# EAGLE design EBH-10 (EAGLE 8.7.0)
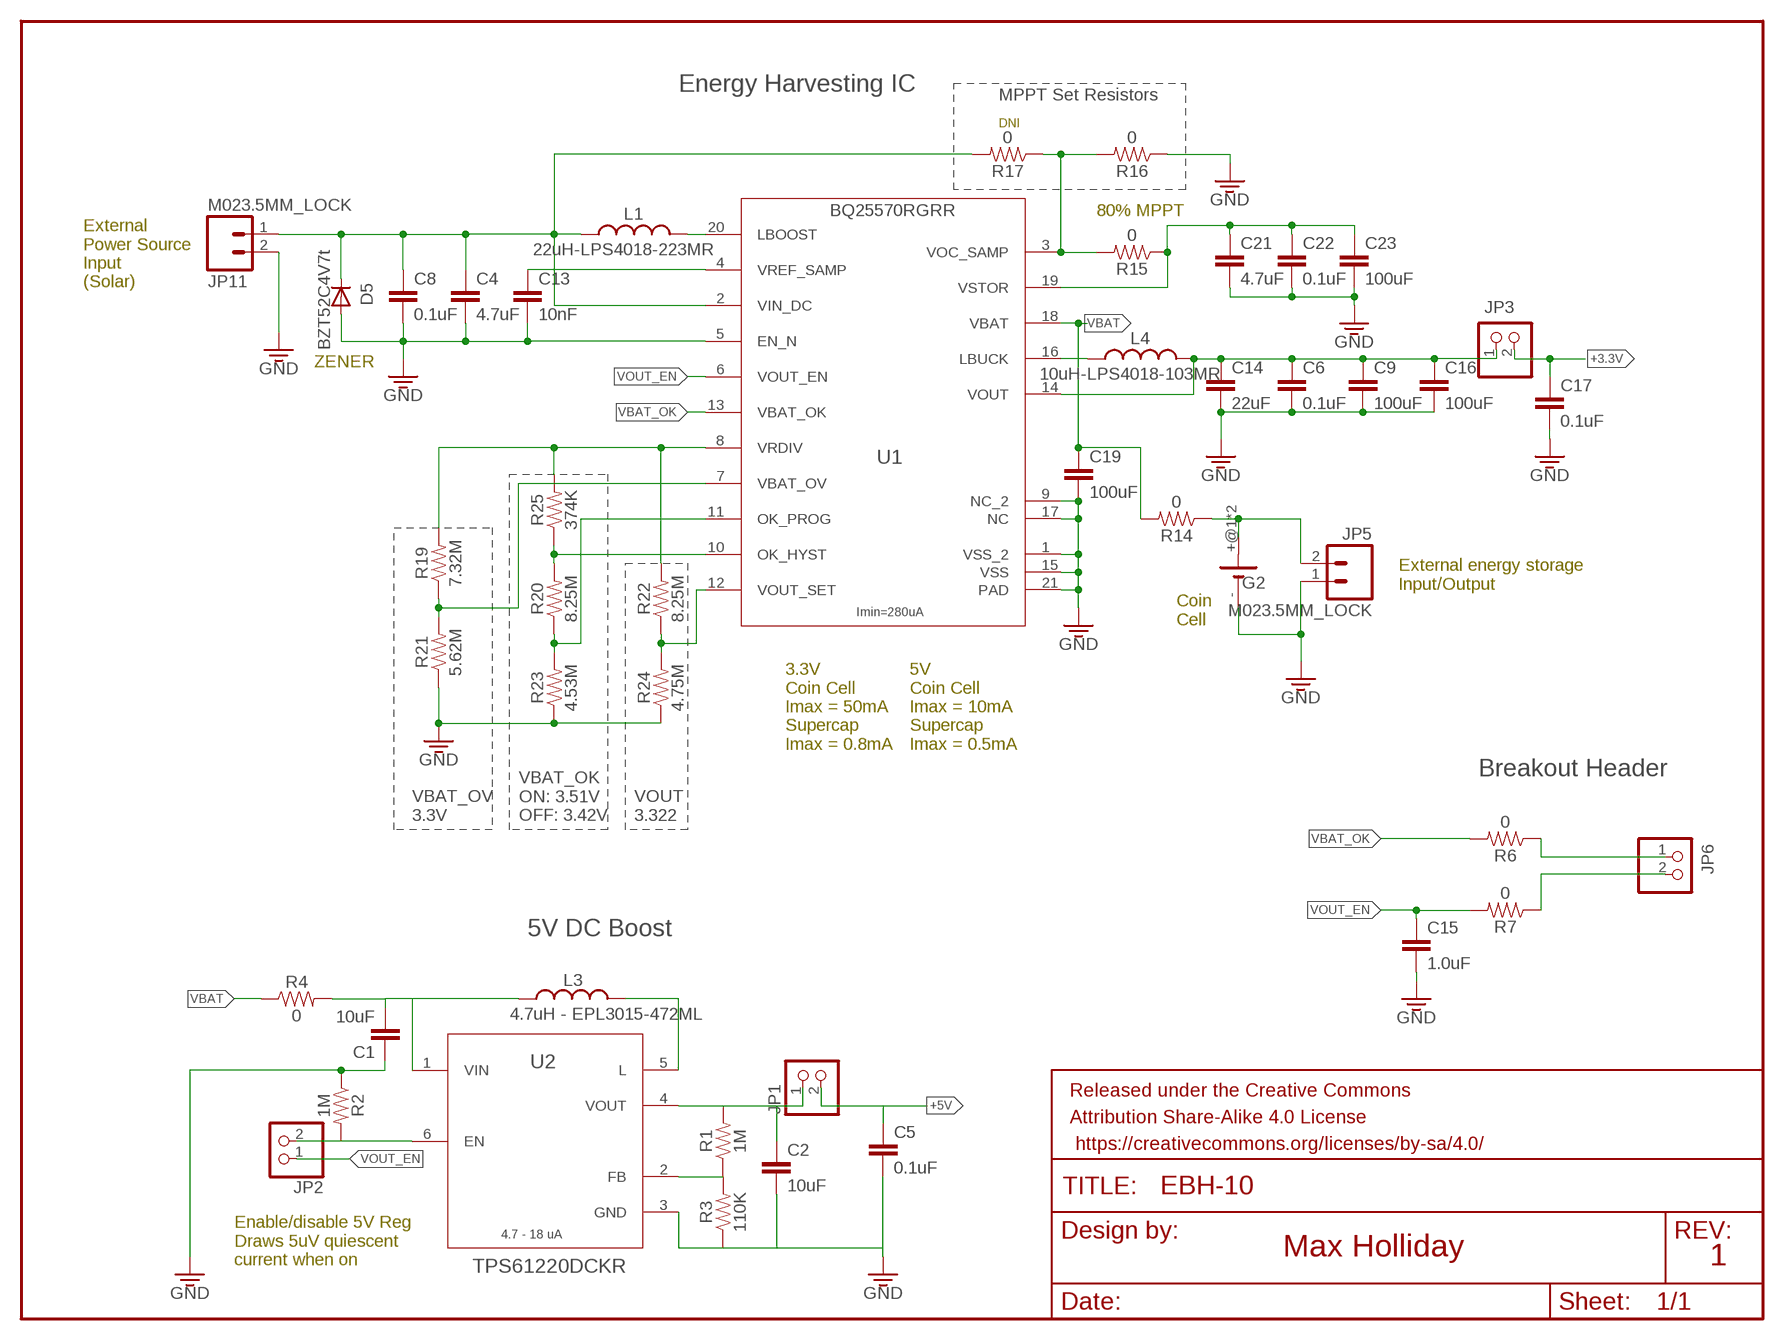
[diagram p0: schematic, sheet 1]

## Parts
C1  10uF  10UF-0603-6.3V-20%  [0603]
C2  10uF  10UF-0603-6.3V-20%  [0603]
C4  4.7uF  4.7UF0603  [0603]
C5  0.1uF  0.1UF-0603-25V-(+80/-20%)  [0603]
C6  0.1uF  0.1UF-0603-25V-(+80/-20%)  [0603]
C8  0.1uF  0.1UF-0603-25V-(+80/-20%)  [0603]
C9  100uF  0.1UF-0603-25V-(+80/-20%)  [0603]
C13  10nF  10NF-0603-50V-10%  [0603]
C14  22uF  22UF-0805-6.3V-20%  [0805]
C15  1.0uF  1.0UF-0603-16V-10%  [0603]
C16  100uF  0.1UF-0603-25V-(+80/-20%)  [0603]
C17  0.1uF  0.1UF-0603-25V-(+80/-20%)  [0603]
C19  100uF  0.1UF-0603-25V-(+80/-20%)  [0603]
C21  4.7uF  4.7UF0603  [0603]
C22  0.1uF  0.1UF-0603-25V-(+80/-20%)  [0603]
C23  100uF  0.1UF-0603-25V-(+80/-20%)  [0603]
D5  BZT52C4V7t  DIODE-SOD523  [SOD523]
FRAME1  FRAME-LETTERNO_PACKAGE  [DUMMY]
G2  10MM_SM_COIN_CELL_CLIP  [10MM_SM_COIN_CELL_CLIP]
JP1  PINHD-1X2  [1X02]
JP2  PINHD-1X2  [1X02]
JP3  PINHD-1X2  [1X02]
JP5  M023.5MM_LOCK  [SCREWTERMINAL-3.5MM-2_LOCK]
JP6  PINHD-1X2  [1X02]
JP11  M023.5MM_LOCK  [SCREWTERMINAL-3.5MM-2_LOCK]
L1  22uH-LPS4018-223MR  COILCRAFT-LPS4018  [LPS4018]
L3  4.7uH - EPL3015-472ML  INDUCTORDFE322512C  [DFE322512C]
L4  10uH-LPS4018-103MR  COILCRAFT-LPS4018  [LPS4018]
R1  1M  1MOHM-0603-1/4W-5%  [0603]
R2  1M  1MOHM-0603-1/4W-5%  [0603]
R3  110K  100KOHM-0603-1/10W-1%  [0603]
R4  0  0OHM-0603-1/10W-5%  [0603]
R6  0  0OHM-0603-1/10W-5%  [0603]
R7  0  0OHM-0603-1/10W-5%  [0603]
R14  0  0OHM-0603-1/10W-5%  [0603]
R15  0  0OHM-0603-1/10W-5%  [0603]
R16  0  0OHM-0603-1/10W-5%  [0603]
R17  0  0OHM-0603-1/10W-5%  [0603]
R19  7.32M  1MOHM-0603-1/4W-5%  [0603]
R20  8.25M  1MOHM-0603-1/4W-5%  [0603]
R21  5.62M  1MOHM-0603-1/4W-5%  [0603]
R22  8.25M  1MOHM-0603-1/4W-5%  [0603]
R23  4.53M  1MOHM-0603-1/4W-5%  [0603]
R24  4.75M  1MOHM-0603-1/4W-5%  [0603]
R25  374K  1MOHM-0603-1/4W-5%  [0603]
U1  Value  BQ25570RGRR  [RGR0020A]
U2  TPS61220DCKR  [DCK0006A]

## Nets
+3.3V: C17.1 JP3.2
+5V: C5.1 JP1.2
GND: C1.1 C2.2 C4.2 C5.2 C6.2 C8.2 C9.2 C13.2 C14.2 C15.2 C16.2 C17.2 C19.2 C21.2 C22.2 C23.2 D5.A G2.- JP5.1 JP11.2 R2.1 R3.1 R16.1 R21.1 R23.1 R24.1 U1.1(VSS_2) U1.5(EN_N) U1.9(NC_2) U1.15(VSS) U1.17(NC) U1.21(PAD) U2.3(GND)
N$1: R1.1 R3.2 U2.2(FB)
N$2: C2.1 JP1.1 R1.2 U2.4(VOUT)
N$3: L3.P$2 U2.5(L)
N$4: C1.2 L3.P$1 R4.2 U2.1(VIN)
N$5: JP2.2 R2.2 U2.6(EN)
N$6: C6.1 C9.1 C14.1 C16.1 JP3.1 L4.2 U1.14(VOUT)
N$7: L4.1 U1.16(LBUCK)
N$8: R15.2 R16.2 R17.1 U1.3(VOC_SAMP)
N$9: G2.+@1(+) G2.+@2(+) JP5.2 R14.1
N$10: C13.1 U1.4(VREF_SAMP)
N$11: C21.1 C22.1 C23.1 R15.1 U1.19(VSTOR)
N$12: JP6.1 R6.1
N$13: JP6.2 R7.1
N$14: L1.2 U1.20(LBOOST)
N$15: C4.1 C8.1 D5.C JP11.1 L1.1 R17.2 U1.2(VIN_DC)
N$20: R19.1 R21.2 U1.7(VBAT_OV)
N$24: R22.1 R24.2 U1.12(VOUT_SET)
N$26: R20.2 R25.1 U1.10(OK_HYST)
N$29: R20.1 R23.2 U1.11(OK_PROG)
N$30: R19.2 R22.2 R25.2 U1.8(VRDIV)
VBAT: C19.1 R4.1 R14.2 U1.18(VBAT)
VBAT_OK: R6.2 U1.13(VBAT_OK)
VOUT_EN: C15.1 JP2.1 R7.2 U1.6(VOUT_EN)

## Notes on the sheet
- Energy Harvesting IC
- MPPT Set Resistors
- DNI
- BQ25570RGRR | 80% MPPT
- External
  Power Source
  Input
  (Solar)
- ZENER
- External energy storage
  Input/Output
- Imin=280uA
- Coin
  Cell
- 3.3V
  Coin Cell
  Imax = 50mA
  Supercap
  Imax = 0.8mA
- 5V
  Coin Cell
  Imax = 10mA
  Supercap
  Imax = 0.5mA
- Breakout Header
- VBAT_OV
  3.3V
- VBAT_OK
  ON: 3.51V
  OFF: 3.42V
- VOUT
  3.322
- 5V DC Boost
- 4.7 - 18 uA
- Max Holliday
- Enable/disable 5V Reg
  Draws 5uV quiescent
  current when on
- 1

## Library data of the parts
C1 C2 = SparkFun-Capacitors:10UF: 10.0µF ceramic capacitors A capacitor is a passive two-terminal electrical component used to store electrical energy temporarily in an electric field.; PROD_ID: CAP-11015
C4 C21 = SparkFun-Capacitors:4.7UF: 4.7µF ceramic capacitors A capacitor is a passive two-terminal electrical component used to store electrical energy temporarily in an electric field.; PROD_ID: CAP-08280
C5 C6 C8 C17 C22 = SparkFun-Capacitors:0.1UF: 0.1µF ceramic capacitors A capacitor is a passive two-terminal electrical component used to store electrical energy temporarily in an electric field.; PROD_ID: CAP-00810
C9 C16 C19 C23 = SparkFun-Capacitors:0.1UF: 0.1µF ceramic capacitors A capacitor is a passive two-terminal electrical component used to store electrical energy temporarily in an electric field.; PROD_ID: CAP-00810; VALUE: 0.1uF
C13 = SparkFun-Capacitors:10NF: 0.01uF/10nF/10,000pF ceramic capacitors A capacitor is a passive two-terminal electrical component used to store electrical energy temporarily in an electric field. CAP-09321; PROD_ID: CAP-00867
C14 = SparkFun-Capacitors:22UF: 22µF ceramic capacitors A capacitor is a passive two-terminal electrical component used to store electrical energy temporarily in an electric field.; PROD_ID: CAP-08402
C15 = SparkFun-Capacitors:1.0UF: 1µF ceramic capacitors A capacitor is a passive two-terminal electrical component used to store electrical energy temporarily in an electric field.; PROD_ID: CAP-00868
D5 = diode:DIODE-: DIODE
FRAME1 = SparkFun-Aesthetics:FRAME-LETTER: Schematic Frame - Letter Standard 8.5x11 US Letter frame; DESIGNER: Nobody; VERSION: v01
G2 = battery:10MM_SM_COIN_CELL_CLIP: Battery cell clip for CR927 Source: KEYSTONE ELECTRONICS CORP. www.keyelco.com, ASTORIA, N.Y. 11105-2017 PART ANME 10mm SM COIN CELl CLIP DWG NO. 3030
JP1-JP3 JP6 = pinhead:PINHD-1X2: PIN HEADER
JP5 JP11 = SparkFun-Connectors:M02: Standard 2-pin 0.1" header. Use with - straight break away headers ( PRT-00116) - right angle break away headers (PRT-00553) - swiss pins (PRT-00743) - machine pins (PRT-00117) - female headers (PRT-00115) Molex polarized connector foot print use with: PRT-08233 with associated crimp pins and housings. 2.54_SCREWTERM for use with PRT-10571. 3.5mm Screw Terminal footprints for PRT-08084 5mm Screw Terminal footprints for use with PRT-08432; PROD_ID: CONN-08399
L1 L4 = passives_lab11:COILCRAFT-LPS4018: Coilcraft Shielded SMT Power Inductors – LPS4018 Series
L3 = passives_lab11:INDUCTOR: A very specific inductor
R1 R2 = SparkFun-Resistors:1MOHM: 1MΩ resistor A resistor is a passive two-terminal electrical component that implements electrical resistance as a circuit element. Resistors act to reduce current flow, and, at the same time, act to lower voltage levels within circuits. - Wikipedia; PROD_ID: RES-07868
R3 = SparkFun-Resistors:100KOHM: 100kΩ resistor A resistor is a passive two-terminal electrical component that implements electrical resistance as a circuit element. Resistors act to reduce current flow, and, at the same time, act to lower voltage levels within circuits. - Wikipedia; PROD_ID: RES-07828; VALUE: 100k
R4 R6 R7 R14-R17 = SparkFun-Resistors:0OHM: 0Ω resistor A resistor is a passive two-terminal electrical component that implements electrical resistance as a circuit element. Resistors act to reduce current flow, and, at the same time, act to lower voltage levels within circuits. - Wikipedia; PROD_ID: RES-08609
R19-R25 = SparkFun-Resistors:1MOHM: 1MΩ resistor A resistor is a passive two-terminal electrical component that implements electrical resistance as a circuit element. Resistors act to reduce current flow, and, at the same time, act to lower voltage levels within circuits. - Wikipedia; PROD_ID: RES-07868; VALUE: 1M
U1 = maholli:BQ25570RGRR; ALTERNATEPARTNUMBER: BQ25570RGRT; APPLICATION_BUILDNUMBER: *; COMPTYPE: IC; MANUFACTURER: Texas Instruments; MOUNTTYPE: SMT; PACKAGEREFERENCE: RGR0020A; PARTNUMBER: BQ25570RGRR; PIN_COUNT: 21; REFDES: RefDes; ROHS: Y; TYPE: TYPE
U2 = maholli:TPS61220DCKR; COMPTYPE: IC; MANUFACTURER: Texas Instruments; MOUNTTYPE: SMT; PACKAGEREFERENCE: DCK0006A; PARTNUMBER: TPS61220DCK; PIN_COUNT: 6; REFDES: RefDes; ROHS: Y; TYPE: TYPE; VALUE: Value

## Board
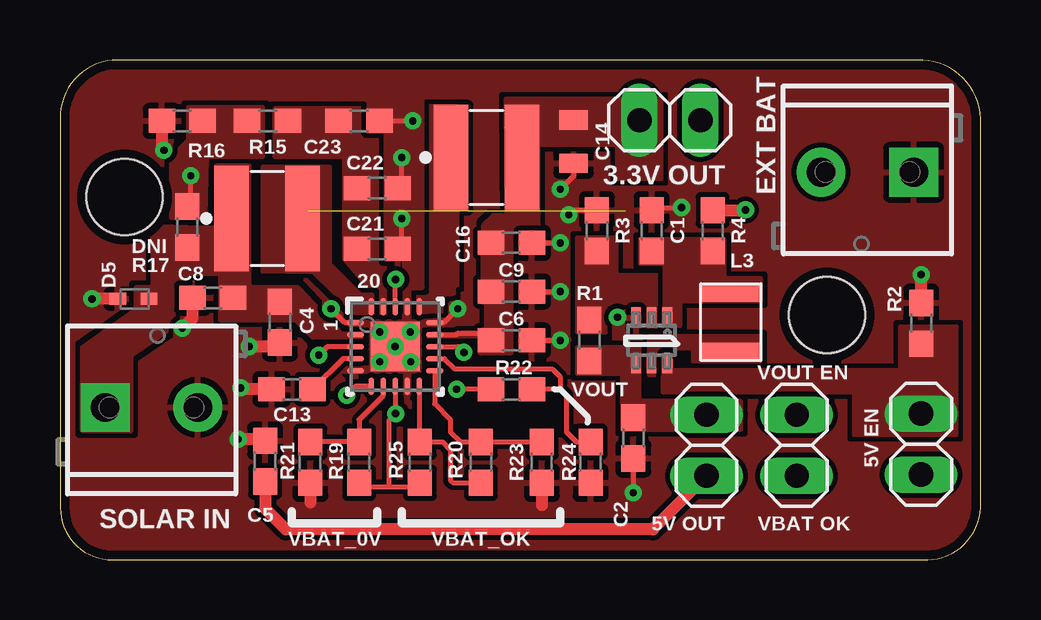
[diagram p1: board, top side]
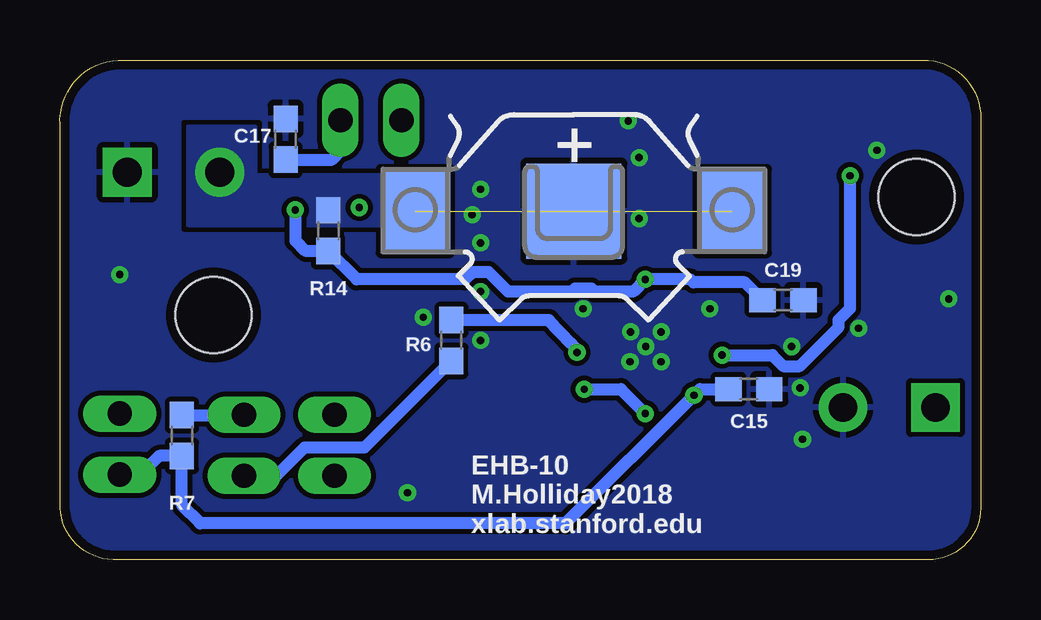
[diagram p2: board, bottom side, seen from below]

Size 38.37 x 20.83 mm. Coordinates in mm from the lower left corner, seen from the top.
Outline: 38.37,2.17 38.37,18.15 arc90 35.95,20.83 2.18,20.83 arc90 0.01,18.15 0.01,2.17 arc90 2.18,0 35.95,0 arc90 38.37,2.17
Copper layers (1*16): Top 0.035559375mm / dielectric 1.6mm / Bottom 0.035559375mm
Design rules "oshpark-2layer *": minimum track width 8mil, minimum drill 12mil, track to track 8mil, track to pad 6mil, pad to pad 6mil, via to via 8mil, smd to smd 6mil, copper to edge 15mil, drill to drill 6mil, minimum pad ring 8mil, minimum via ring 8mil, stop-mask expansion 2.5mil, vias tented up to drill 0mil, thermal gap 10mil
Holes 3.17 mm at 2.68,15.11 31.97,10.21

### Footprints (pad centres in the part's own frame; a part is rotated, then mirrored left to right if it is on the bottom)
0603 = smd 1.1 x 1: 1 -0.85,0; 2 0.85,0
0805 = smd 0.8 x 1.2: 1 -0.9,0; 2 0.9,0
SOD523 = smd 0.7 x 0.5: A 0.7,0; C -0.6,0
10MM_SM_COIN_CELL_CLIP = smd 2.9 x 3.5: +@1 -6.6,0; +@2 6.6,0 | smd 3.96 x 3.96: - 0,0
1X02 = drill 1.016 long: 1 -1.27,0; 2 1.27,0
SCREWTERMINAL-3.5MM-2_LOCK = drill 1.2 pad 2.032 square: 1 -0.178,0 | drill 1.2 pad 2.032: 2 3.678,0
LPS4018 = smd 1.435 x 4.394: 1 -1.48,0; 2 1.48,0
DFE322512C = smd 0.75 x 2.5: P$1 1.225,0; P$2 -1.225,0
RGR0020A = smd 0.724 x 0.229: 1 -1.65,1; 2 -1.65,0.5; 3 -1.65,0; 4 -1.65,-0.5; 5 -1.65,-1; 11 1.65,-1; 12 1.65,-0.5; 13 1.65,0; 14 1.65,0.5; 15 1.65,1 | smd 0.229 x 0.724: 6 -1,-1.65; 7 -0.5,-1.65; 8 0,-1.65; 9 0.5,-1.65; 10 1,-1.65; 16 1,1.65; 17 0.5,1.65; 18 0,1.65; 19 -0.5,1.65; 20 -1,1.65 | smd 2.05 x 2.05: 21 0,0 | smd 0.5 x 0.5: V 0,-0.14
DCK0006A = smd 0.85 x 0.4: 1 -0.95,0.65; 2 -0.95,0; 3 -0.95,-0.65; 4 0.95,-0.65; 5 0.95,0; 6 0.95,0.65

### Placement (x,y rotation side)
C1  24.65,13.72 270 top
C2  23.89,5.08 270 top
C4  9.16,9.91 270 top
C5  8.55,4.12 90 top
C6  18.81,9.15 0 top
C8  6.36,10.92 180 top
C9  18.81,11.18 0 top
C13  9.67,7.11 180 top
C14  21.4,17.43 270 top
C15  9.67,7.11 0 bottom
C16  18.81,13.21 0 top
C17  28.97,17.53 90 bottom
C19  8.24,10.82 0 bottom
C21  13.22,12.96 0 top
C22  13.22,15.5 0 top
C23  12.46,18.29 0 top
D5  3.11,10.87 180 top
FRAME1  17.59,21.82 90 top
G2  16.96,14.53 0 bottom
JP1  26.94,4.78 270 top
JP2  35.88,4.83 90 top
JP3  25.41,18.32 0 top
JP5  35.39,16.16 180 top
JP6  30.7,4.78 90 top
JP11  2.07,6.35 0 top
L1  8.63,14.23 0 top
L3  27.95,9.91 90 top
L4  17.77,16.77 0 top
R1  22.06,9.15 270 top
R2  35.88,9.86 270 top
R3  22.37,13.72 270 top
R4  27.19,13.72 270 top
R6  22.06,9.15 90 bottom
R7  33.29,5.18 270 bottom
R14  27.19,13.72 270 bottom
R15  8.65,18.29 180 top
R16  5.09,18.29 0 top
R17  5.3,13.87 270 top
R19  12.46,4.07 270 top
R20  17.54,4.07 270 top
R21  10.43,4.07 90 top
R22  18.81,7.11 180 top
R23  20.08,4.07 90 top
R24  22.11,4.07 90 top
R25  15,4.07 270 top
U1  13.96,8.89 0 top
U2  24.65,9.15 270 top

### Tracks (layer width: path | path; a pad name or v marks a point on that pad's centre or on a via)
+3.3V
  Bottom 0.508: C17.1 27.03,16.68 26.68,17.02 JP3.2
+5V
  Top 0.508: C5.1 8.55,2.14 9.41,1.27 24.7,1.27 JP1.2
GND  (via drill 0.3)
  Top 0.203: U1.21 13.35,9.5 v13.32,9.5 | U1.21 14.57,9.5 v14.59,9.5 | U1.21 14.57,8.28 v14.62,8.26 | U1.21 13.35,8.28 v13.32,8.26 | 19.91,3.05 R23.1 | C16.2 v20.84,13.21 | C9.2 v20.84,11.18 | C6.2 v20.84,9.15 | C21.2 14.24,13.12 v14.24,14.23 | C22.2 14.24,15.66 v14.24,16.77 | 5.35,11.09 C8.2 5.6,10.84 | C2.2 v23.89,2.8 | U1.1 11.87,9.89 v11.29,10.47 | C23.2 v14.69,18.29 | C14.2 21.4,16 v20.84,15.44 | R3.1 21.39,14.57 v21.2,14.38 | C1.1 24.77,14.68 v25.9,14.68 | U1.15 16,9.89 v16.57,10.47
  Top 0.508: 10.59,3.05 R21.1 10.43,2.39 | C4.2 8.99,8.89 v7.89,8.89 | D5.A v1.33,10.87 | R16.1 4.24,17.16 v4.33,17.07 | C5.2 8.48,5.03 v7.43,5.03 | C13.2 7.58,7.11 v7.53,7.16 | R23.1 20.08,2.29 | R2.1 v35.88,11.89 | C8.2 5.51,10.07 v5.09,9.65
  other vias: 13.96,8.89 23.23,10.11
  pour Top (no thermals): 12.05,9.81 12.92,9.81 12.97,9.76 12.97,7.98 11.95,7.98 11.95,7.88 14.39,7.88 14.39,6.91 14.54,6.91 14.54,7.88 15,7.88 15,9.81 17.39,9.81 17.39,10.42 17.13,10.42 17.13,11.08 16.78,11.08 16.78,10.67 16.27,10.67 16.27,10.06 16.22,10.01 14.54,9.91 14.54,11.33 15.05,11.33 15.1,11.38 15.1,19.26 12.87,19.26 12.87,17.88 13.58,17.88 13.58,12.55 14.34,12.55 14.34,9.91 12.05,9.91
  pour Bottom (rank 2): 0.01,20.83 38.37,20.83 38.37,0 0.01,0
  pour Top (rank 4): 0.01,20.83 38.37,20.83 38.37,0 0.01,0
N$1
  pour Top (rank 2, no thermals): 24.91,9.76 24.91,11.84 23.18,11.84 23.18,13.41 21.55,13.41 21.55,9.5 22.72,9.5 22.72,10.67 24.55,10.67 24.55,9.76
N$2
  pour Top (no thermals): 24.14,8.84 21.55,8.84 21.55,7.77 23.43,7.77 23.43,5.44 28.36,5.44 28.36,6.61 24.14,6.61
N$3
  pour Top (rank 2, no thermals): 24.55,7.72 24.85,7.72 24.85,8.84 26.38,8.84 26.38,8.28 29.17,8.28 29.17,9.3 24.55,9.3
N$4
  pour Top (no thermals): 25.21,9.76 25.21,12.35 24.19,12.35 24.19,13.36 27.65,13.36 27.65,11.74 29.17,11.74 29.17,10.77 25.82,10.77 25.82,9.76
N$5
  pour Top (no thermals): 25.11,8.33 25.11,7.01 33.08,7.01 33.08,5.23 37.35,5.23 37.35,9.7 35.01,9.7 35.01,7.88 25.46,7.88 25.46,8.33
N$6
  Top 0.203: U1.14 16.52,9.39 16.57,9.45 17.65,9.45 C6.1
  pour Top (rank 2, no thermals): 18.81,8.64 18.81,13.72 19.93,13.72 19.93,17.32 23.23,17.32 23.23,15.9 25.06,15.9 25.06,19.2 18.58,19.2 18.61,14.33 18.05,14.33 17.64,13.92 17.59,9.86 15.3,9.86 15.3,9.35 17.49,9.35 17.49,8.64
N$7
  pour Top (rank 2, no thermals): 14.95,10.31 14.95,11.03 15.41,11.03 15.41,18.9 16.52,18.9 16.52,10.31
N$8  (via drill 0.3)
  Top 0.203: U1.3 11.14,8.89 v10.78,8.54 | R17.1 5.45,14.87 v5.45,16
  Bottom 0.508: v10.78,8.54 8.68,8.54 8.22,8.08 7.55,8.08 5.93,9.7 5.93,10 5.45,10.48 v5.45,16
  pour Top (no thermals): 8.45,18.85 5.35,18.85 5.35,17.48 4.64,16.77 4.64,14.28 6.06,14.28 6.11,16.82 8.45,16.82
N$9  (1 unrouted)
  pour Bottom (no thermals): 22.37,13.97 22.37,16 30.24,16 30.24,18.04 33.03,18.04 33.03,13.97
N$10
  Top 0.203: U1.4 11.79,8.39 C13.1
N$11
  pour Top (rank 2, no thermals): 13.53,10.26 13.53,12.24 13.22,12.24 13.22,18.8 8.95,18.8 8.95,16.82 11.85,16.82 11.85,12.55 12.87,11.33 13.32,11.33 13.32,10.26
N$12
  Bottom 0.508: R6.1 25.68,4.68 28.18,4.68 29.35,3.51 JP6.1
N$13
  Bottom 0.508: R7.1 30.71,6.03 JP6.2
N$14
  pour Top (no thermals): 13.02,10.31 13.02,11.03 12.51,11.03 11.24,12.3 11.24,16.36 8.45,16.36 8.45,12.04 10.53,12.04 12.31,10.31
N$15
  pour Top (no thermals): 12.56,9.4 11.75,9.4 9.92,11.33 7.89,11.33 7.89,16.41 6.52,16.41 6.52,13.82 4.64,13.82 4.64,11.94 6.67,11.94 6.67,10.01 9.82,10.01 10.53,9.3 12.56,9.3
  pour Top (no thermals): 0.93,5.39 2.96,5.39 2.96,8.54 5.25,10.06 5.25,13.87 3.87,13.87 3.87,11.33 3.16,11.33 3.16,10.42 0.93,8.84
N$20
  Top 0.203: U1.7 13.46,6.85 12.46,5.84 R19.1 R21.2
N$24
  Top 0.203: 20.84,7.11 R22.1 | U1.12 16.02,8.39 16.45,7.96 20.51,7.96 20.84,7.62 20.84,7.11 | 20.84,7.11 21.1,6.86 21.1,5.34 21.52,4.92 R24.2
N$26
  Top 0.203: U1.10 14.96,4.95 R25.1 15.93,4.92 16.27,4.57 16.27,3.3 16.36,3.22 R20.2
N$29
  Top 0.203: R23.2 R20.1 16.69,4.92 16.27,5.34 16.27,5.84 15.61,6.5 U1.11 15.63,7.88
N$30  (via drill 0.3)
  Top 0.203: R19.2 12.63,3.05 13.73,3.05 | 13.73,3.05 14.83,3.05 R25.2 | U1.8 13.96,6.12 v13.98,6.1 13.73,5.84 13.73,3.05 | R22.2 v16.52,7.11
  Bottom 0.508: v16.52,7.11 15,7.11 v13.98,6.1
VBAT  (via drill 0.3)
  Top 0.203: U1.18 13.96,11.67 v13.98,11.69
  Top 0.508: R4.1 28.55,14.57 v28.56,14.58
  Bottom 0.508: C19.1 9.83,11.56 11.98,11.56 12.1,11.69 v13.98,11.69 14.49,11.18 16.1,11.18 16.23,11.3 16.92,11.3 17.04,11.18 19.69,11.18 20.5,11.99 21.18,11.99 21.48,11.69 26.01,11.69 R14.2 28.12,12.87 28.55,13.3 28.55,14.57 v28.56,14.58
VBAT_OK  (via drill 0.3)
  Top 0.203: U1.13 16.58,8.89 v16.83,8.65
  Bottom 0.203: 17.06,9.01 17.06,8.88 v16.83,8.65
  Bottom 0.508: 16.85,8.79 17.06,9.01 18,10 R6.2
VOUT_EN  (via drill 0.3)
  Top 0.203: U1.6 12.33,7.24 v11.95,6.86
  Bottom 0.508: C15.1 11.7,7.11 v11.95,6.86 17.29,1.53 32.53,1.53 33.29,2.29 R7.2 34.24,4.33 35.01,3.56 JP2.1

### Text on the board
tPlace: 3.3V OUT | EXT BAT | DNI | 20 | 1 | VOUT EN | VOUT | 5V EN | SOLAR IN | VBAT_0V | VBAT_OK | 5V OUT | VBAT OK
bPlace: EHB-10 / M.Holliday2018 / xlab.stanford.edu